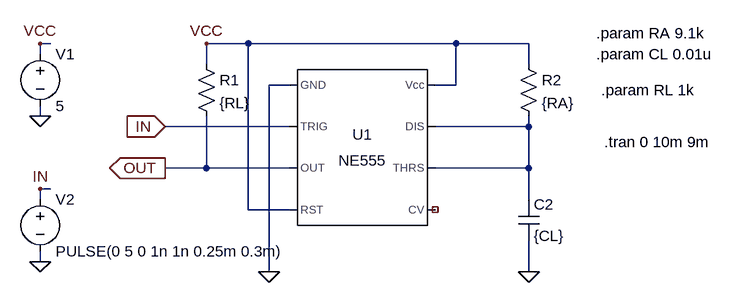
[diagram p0: schematic 555_Monostable.asc]
555_Monostable.asc, the LTspice schematic file:
Version 4
SHEET 1 880 680
WIRE -256 16 -272 16
WIRE 48 16 -16 16
WIRE 368 16 48 16
WIRE 480 16 368 16
WIRE -272 32 -272 16
WIRE -16 48 -16 16
WIRE 480 48 480 16
WIRE 112 80 80 80
WIRE 368 80 368 16
WIRE 368 80 336 80
WIRE -272 128 -272 112
WIRE 112 144 -80 144
WIRE 480 144 480 128
WIRE 480 144 336 144
WIRE -16 208 -16 128
WIRE -16 208 -80 208
WIRE 112 208 -16 208
WIRE 480 208 480 144
WIRE 480 208 336 208
WIRE -256 240 -272 240
WIRE -272 256 -272 240
WIRE 480 256 480 208
WIRE 48 272 48 16
WIRE 112 272 48 272
WIRE -272 352 -272 336
WIRE 80 368 80 80
WIRE 480 368 480 320
FLAG 80 368 0
FLAG -80 144 IN
IOPIN -80 144 In
FLAG -80 208 OUT
IOPIN -80 208 Out
FLAG -16 16 VCC
FLAG -272 128 0
FLAG -272 16 VCC
FLAG -272 352 0
FLAG -272 240 IN
FLAG 480 368 0
SYMBOL Misc\\NE555 224 176 R0
SYMATTR InstName U1
SYMBOL res 464 32 R0
SYMATTR InstName R2
SYMATTR Value {RA}
SYMBOL voltage -272 16 R0
WINDOW 123 0 0 Left 2
WINDOW 39 0 0 Left 2
SYMATTR InstName V1
SYMATTR Value 5
SYMBOL voltage -272 240 R0
WINDOW 123 0 0 Left 2
WINDOW 39 0 0 Left 2
SYMATTR InstName V2
SYMATTR Value PULSE(0 5 0 1n 1n 0.25m 0.3m)
SYMBOL cap 464 256 R0
SYMATTR InstName C2
SYMATTR Value {CL}
SYMBOL res -32 32 R0
SYMATTR InstName R1
SYMATTR Value {RL}
TEXT 584 0 Left 2 !.param RA 9.1k
TEXT 584 32 Left 2 !.param CL 0.01u
TEXT 592 88 Left 2 !.param RL 1k
TEXT 596 168 Left 2 !.tran 0 10m 9m

The netlist it stands for:
* 555_Monostable.asc
XU1 0 IN OUT VCC NC_01 N001 N001 VCC NE555  ; pins GND TRIG OUT RST CV THRS DIS Vcc
R2 VCC N001 {RA}
V1 VCC 0 5
V2 IN 0 PULSE(0 5 0 1n 1n 0.25m 0.3m)
C2 N001 0 {CL}
R1 VCC OUT {RL}
.param RA 9.1k
.param CL 0.01u
.param RL 1k
.tran 0 10m 9m
.lib NE555.sub
.backanno
.end